# EAGLE design Spring2020 (EAGLE 9.6.2)
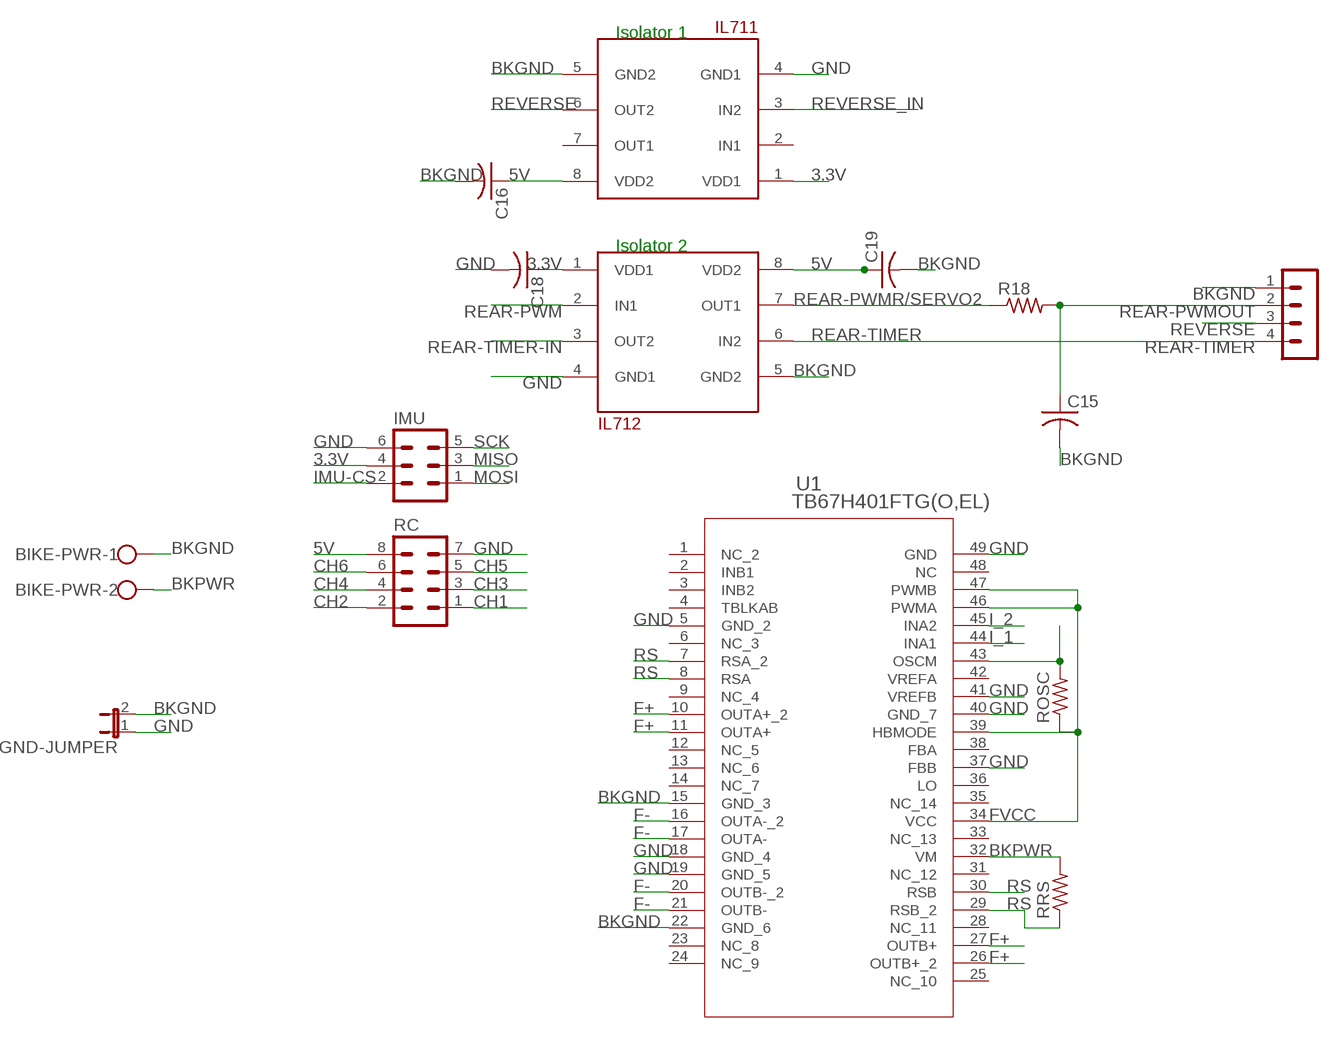
[diagram p0: schematic, sheet 1]

## Parts
BIKE-PWR  W237-102  [W237-102]
C15  C-US025-050X050  [C025-050X050]
C16  C-US025-050X050  [C025-050X050]
C18  C-US025-050X050  [C025-050X050]
C19  C-US025-050X050  [C025-050X050]
GND-JUMPER  JP1E  [JP1]
IMU  MA03-2  [MA03-2]
R18  R-US_0414/15  [0414/15]
RC  MA04-2  [MA04-2]
REAR-MOTOR  MA04-1  [MA04-1]
ROSC  R-US_0309/10  [0309/10]
RRS  R-US_0309/10  [0309/10]
U1  TB67H401FTG(O,EL)  [P-VQFN48-0707-0P50-004_TOS]
U$2  IL-711  [8PINSOIC]
U$7  IL-712  [8PINSOIC]

## Nets
3.3V: C18.1 IMU.4 U$2.1(VDD1) U$7.1(VDD1)
5V: C16.1 C19.1 RC.8 U$2.8(VDD2) U$7.8(VDD2)
BKGND: BIKE-PWR.1 C15.2 C16.2 C19.2 GND-JUMPER.2 REAR-MOTOR.1 U1.15(GND_3) U1.22(GND_6) U$2.5(GND2) U$7.5(GND2)
BKPWR: BIKE-PWR.2 RRS.2 U1.32(VM)
CH1: RC.1
CH2: RC.2
CH3: RC.3
CH4: RC.4
CH5: RC.5
CH6: RC.6
F+: U1.10(OUTA+_2) U1.11(OUTA+) U1.26(OUTB+_2) U1.27(OUTB+)
F-: U1.16(OUTA-_2) U1.17(OUTA-) U1.20(OUTB-_2) U1.21(OUTB-)
FVCC: ROSC.1 U1.34(VCC) U1.39(HBMODE) U1.46(PWMA) U1.47(PWMB)
GND: C18.2 GND-JUMPER.1 IMU.6 RC.7 U1.5(GND_2) U1.18(GND_4) U1.19(GND_5) U1.37(FBB) U1.40(GND_7) U1.41(VREFB) U1.49(GND) U$2.4(GND1) U$7.4(GND1)
I_1: U1.44(INA1)
I_2: U1.45(INA2)
IMU-CS: IMU.2
MISO: IMU.3
MOSI: IMU.1
N$5: ROSC.2 U1.43(OSCM)
REAR-PWM: U$7.2(IN1)
REAR-PWMOUT: C15.1 R18.2 REAR-MOTOR.2
REAR-PWMR/SERVO2: R18.1 U$7.7(OUT1)
REAR-TIMER: REAR-MOTOR.4 U$7.6(IN2)
REAR-TIMER-IN: U$7.3(OUT2)
REVERSE: REAR-MOTOR.3 U$2.6(OUT2)
REVERSE_IN: U$2.3(IN2)
RS: RRS.1 U1.7(RSA_2) U1.8(RSA) U1.29(RSB_2) U1.30(RSB)
SCK: IMU.5
Unconnected: U1.1(NC_2) U1.2(INB1) U1.3(INB2) U1.4(TBLKAB) U1.6(NC_3) U1.9(NC_4) U1.12(NC_5) U1.13(NC_6) U1.14(NC_7) U1.23(NC_8) U1.24(NC_9) U1.25(NC_10) U1.28(NC_11) U1.31(NC_12) U1.33(NC_13) U1.35(NC_14) U1.36(LO) U1.38(FBA) U1.48(NC) U$2.2(IN1) U$2.7(OUT1)

## Notes on the sheet
- Isolator 1
- Isolator 2

## Power pins joined to a net without a drawn wire
VREFA: U1.42(VREFA)

## Library data of the parts
BIKE-PWR = con-wago-500:W237-102: WAGO SCREW CLAMP; MPN: 237-102; OC_FARNELL: unknown; OC_NEWARK: 70K9898
C15 C16 C18 C19 = resistor:C-US: CAPACITOR, American symbol
GND-JUMPER = jumper:JP1E: JUMPER
IMU = con-lstb:MA03-2: PIN HEADER; OC_FARNELL: unknown; OC_NEWARK: unknown
R18 = resistor:R-US_: RESISTOR, American symbol
RC = con-lstb:MA04-2: PIN HEADER; OC_FARNELL: unknown; OC_NEWARK: unknown
REAR-MOTOR = con-lstb:MA04-1: PIN HEADER; OC_FARNELL: unknown; OC_NEWARK: unknown
ROSC RRS = rcl:R-US_: RESISTOR, American symbol
U1 = mclr:TB67H401FTG(O,EL); COPYRIGHT: Copyright (C) 2022 Ultra Librarian. All rights reserved.; DIGI-KEY_PART_NUMBER_1: TB67H401FTG(OEL)TR-ND; DIGI-KEY_PART_NUMBER_2: TB67H401FTG(OEL)CT-ND; DIGI-KEY_PART_NUMBER_3: TB67H401FTG(OEL)DKR-ND; MANUFACTURER_PART_NUMBER: TB67H401FTG(O,EL); MFR_NAME: Toshiba Electronic Devices & Storage Co.
U$2 = Spring2016Optoisolator:IL-711
U$7 = Spring2016Optoisolator:IL-712

## Board
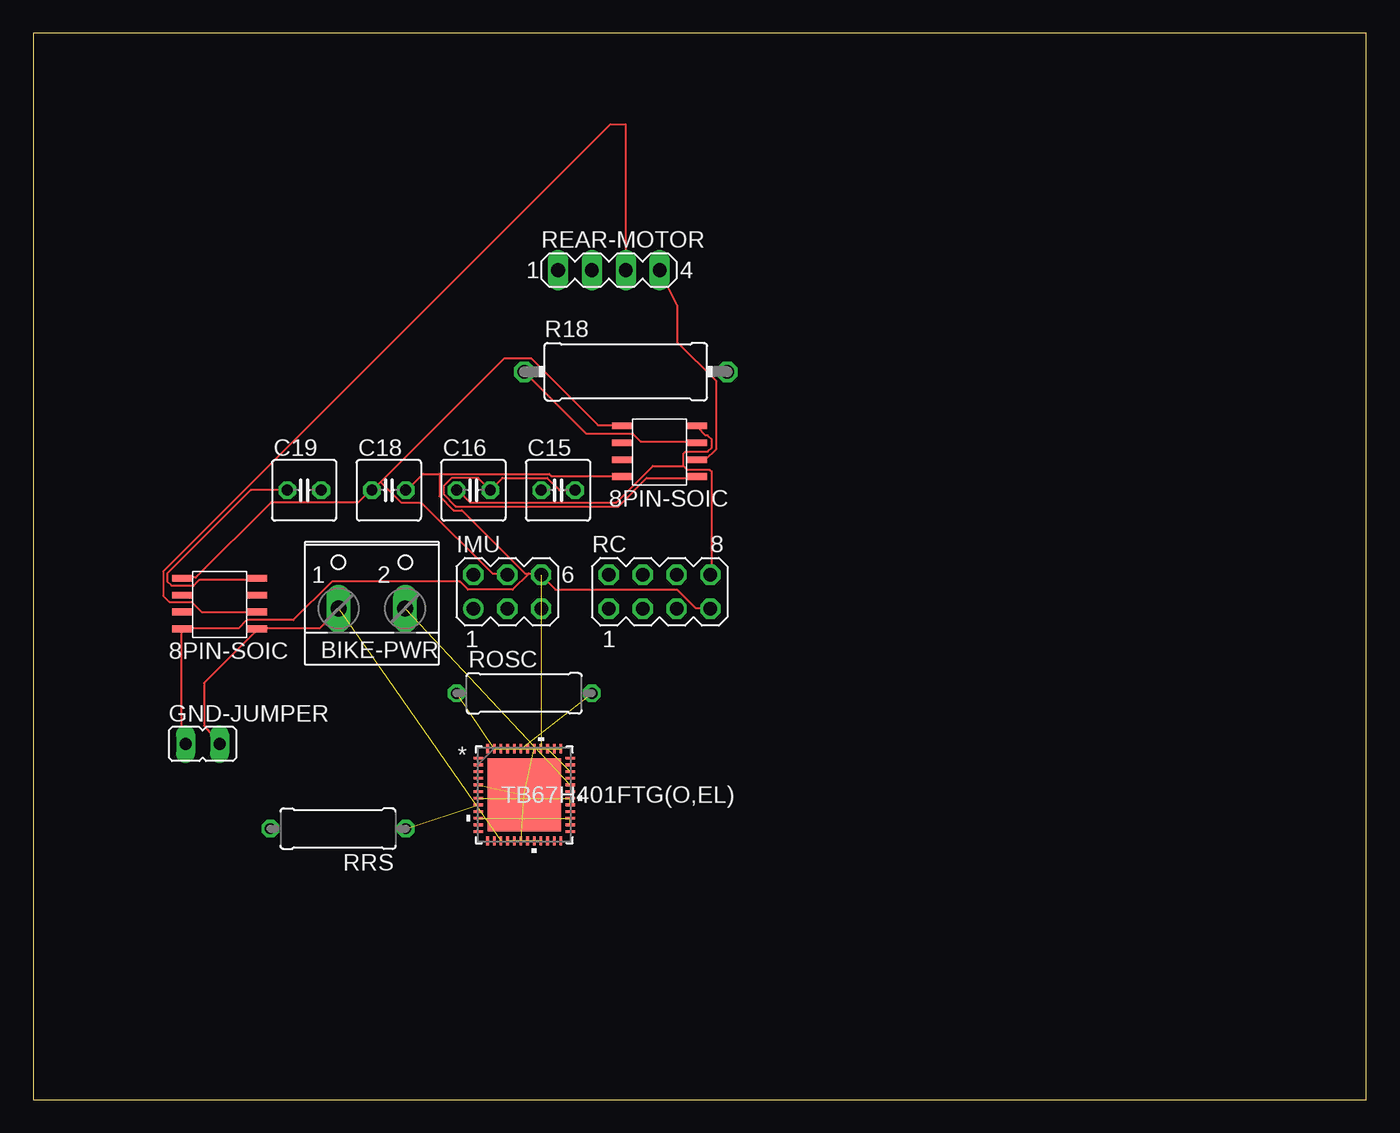
[diagram p1: board, top side]
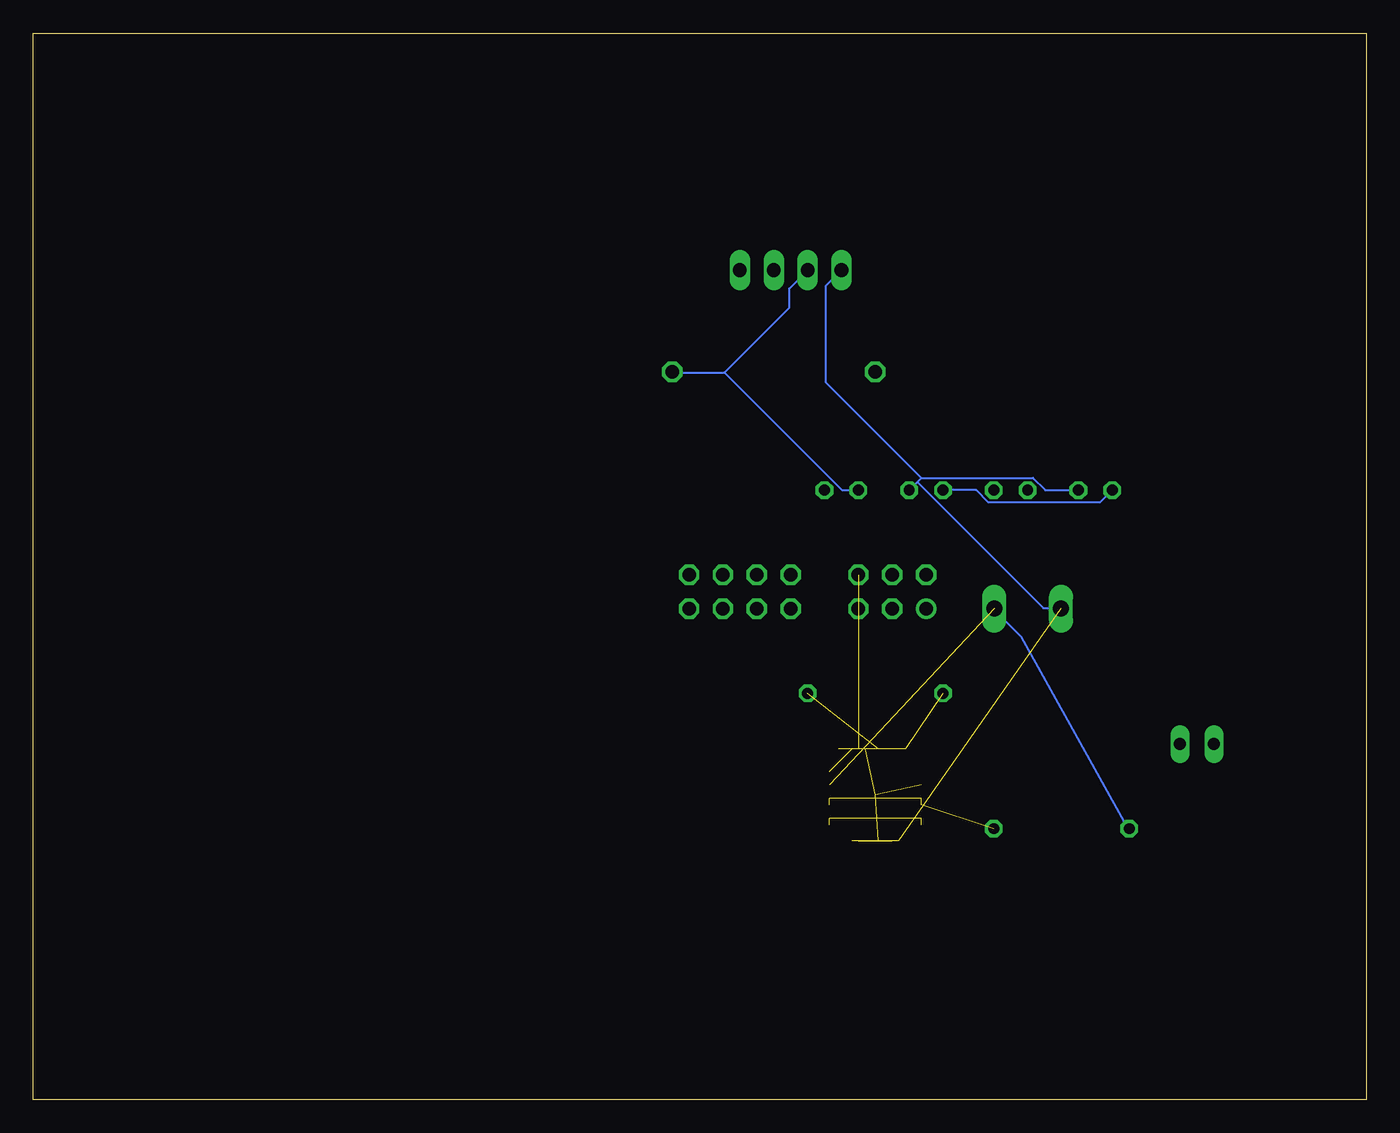
[diagram p2: board, bottom side, seen from below]

Size 100 x 80 mm. Coordinates in mm from the lower left corner, seen from the top.
Outline: 0,0 100,0 100,80 0,80 0,0
Copper layers (1*16): Top 0.035mm / dielectric 1.5mm / Bottom 0.035mm
Design rules "default": minimum track width 6mil, minimum drill 0.35mm, track to track 6mil, track to pad 6mil, pad to pad 6mil, via to via 6mil, smd to smd 6mil, copper to edge 40mil, drill to drill 6mil, minimum pad ring 10mil, minimum via ring 8mil, stop-mask expansion 4mil, vias tented up to drill 0mil, thermal gap 10mil

### Footprints (pad centres in the part's own frame; a part is rotated, then mirrored left to right if it is on the bottom)
W237-102 = drill 1.194 long: 1 -2.5,-1.27; 2 2.5,-1.27
C025-050X050 = drill 0.813 octagon: 1 -1.27,0; 2 1.27,0
JP1 = drill 0.914 long: 1 0,-1.27; 2 0,1.27
MA03-2 = drill 1.016: 1 -2.54,-1.27 | drill 1.016 octagon: 2 -2.54,1.27; 3 0,-1.27; 4 0,1.27; 5 2.54,-1.27; 6 2.54,1.27
0414/15 = drill 1.016 octagon: 1 -7.62,0; 2 7.62,0
MA04-2 = drill 1.016 octagon: 1 -3.81,-1.27; 2 -3.81,1.27; 3 -1.27,-1.27; 4 -1.27,1.27; 5 1.27,-1.27; 6 1.27,1.27; 7 3.81,-1.27; 8 3.81,1.27
MA04-1 = drill 1.016 long: 1 -3.81,0; 2 -1.27,0; 3 1.27,0; 4 3.81,0
0309/10 = drill 0.813 octagon: 1 -5.08,0; 2 5.08,0
P-VQFN48-0707-0P50-004_TOS = smd 0.705 x 0.199: 1 -3.452,2.75; 2 -3.452,2.25; 3 -3.452,1.75; 4 -3.452,1.25; 5 -3.452,0.75; 6 -3.452,0.25; 7 -3.452,-0.25; 8 -3.452,-0.75; 9 -3.452,-1.25; 10 -3.452,-1.75; 11 -3.452,-2.25; 12 -3.452,-2.75; 25 3.452,-2.75; 26 3.452,-2.25; 27 3.452,-1.75; 28 3.452,-1.25; 29 3.452,-0.75; 30 3.452,-0.25; 31 3.452,0.25; 32 3.452,0.75; 33 3.452,1.25; 34 3.452,1.75; 35 3.452,2.25; 36 3.452,2.75 | smd 0.199 x 0.705: 13 -2.75,-3.452; 14 -2.25,-3.452; 15 -1.75,-3.452; 16 -1.25,-3.452; 17 -0.75,-3.452; 18 -0.25,-3.452; 19 0.25,-3.452; 20 0.75,-3.452; 21 1.25,-3.452; 22 1.75,-3.452; 23 2.25,-3.452; 24 2.75,-3.452; 37 2.75,3.452; 38 2.25,3.452; 39 1.75,3.452; 40 1.25,3.452; 41 0.75,3.452; 42 0.25,3.452; 43 -0.25,3.452; 44 -0.75,3.452; 45 -1.25,3.452; 46 -1.75,3.452; 47 -2.25,3.452; 48 -2.75,3.452 | smd 5.5 x 5.5: 49 0,0
8PINSOIC = smd 1.524 x 0.508: 1 -2.794,2.286; 2 -2.794,1.016; 3 -2.794,-0.254; 4 -2.794,-1.524; 5 2.794,-1.524; 6 2.794,-0.254; 7 2.794,1.016; 8 2.794,2.286

### Placement (x,y rotation side)
BIKE-PWR  25.4,38.1 0 top
C15  39.37,45.72 0 top
C16  33.02,45.72 0 top
C18  26.67,45.72 0 top
C19  20.32,45.72 0 top
GND-JUMPER  12.7,26.67 270 top
IMU  35.56,38.1 0 top
R18  44.45,54.61 0 top
RC  46.99,38.1 0 top
REAR-MOTOR  43.18,62.23 0 top
ROSC  36.83,30.48 0 top
RRS  22.86,20.32 180 top
U1  36.83,22.86 0 top
U$2  13.97,36.83 0 top
U$7  46.99,48.26 0 top

### Tracks (layer width: path | path; a pad name or v marks a point on that pad's centre or on a via)
3.3V
  Top 0.152: U$2.1 11.28,39.17 12.19,39.17 17.83,44.81 24.38,44.81 25.3,45.72 C18.1 25.45,45.72 26.06,46.33 | 26.06,46.33 35.36,55.63 37.34,55.63 42.37,50.6 44.2,50.6 U$7.1 | 26.06,46.33 27.58,44.81 29.11,44.81 34.44,39.47 35.51,39.47 IMU.4
5V
  Top 0.152: 48.77,47.55 48.77,48.46 48.92,48.62 50.6,48.62 50.9,48.92 50.9,49.53 50.6,49.84 50.44,49.84 49.84,50.44 U$7.8 | 48.77,47.55 49.07,47.24 50.75,47.24 50.9,47.09 50.9,39.47 RC.8 | C19.1 16.31,45.72 10.06,39.47 10.06,38.86 10.36,38.56 12.04,38.56 12.5,39.01 16.76,39.01 U$2.8 | 48.77,47.55 46.48,47.55 43.74,44.81 32.77,44.81 31.85,45.72 C16.1
  Bottom 0.152: C16.1 29.26,45.72 28.35,44.81 19.96,44.81 C19.1
BKGND  (2 unrouted)
  Top 0.152: BIKE-PWR.1 22.86,36.73 21.49,35.36 16.76,35.36 U$2.5 16.76,35.2 12.8,31.24 12.8,28.04 GND-JUMPER.2 | U$7.5 49.68,46.63 46.02,46.63 43.89,44.5 31.7,44.5 30.79,45.41 30.79,46.02 31.39,46.63 33.38,46.63 C16.2 35.2,46.63 38.56,46.63 39.47,45.72 C15.2
  Bottom 0.152: C19.2 24.08,45.72 24.99,46.63 33.38,46.63 | C16.2 33.68,46.33 | 33.68,46.33 33.38,46.63 | 33.38,46.63 40.54,53.8 40.54,61.06 REAR-MOTOR.1 | 33.68,46.33 24.23,36.88 23.01,36.88 BIKE-PWR.1
BKPWR  (1 unrouted)
  Bottom 0.152: RRS.2 17.98,20.52 25.91,34.75 27.89,36.73 BIKE-PWR.2
F+  (3 unrouted)
F-  (3 unrouted)
FVCC  (4 unrouted)
GND  (7 unrouted)
  Top 0.152: GND-JUMPER.1 11.12,26.98 11.12,35.2 U$2.4 11.28,35.36 15.39,35.36 16,35.97 19.51,35.97 22.4,38.86 32,38.86 32.61,38.25 35.97,38.25 37.19,39.47 | 30.48,46.94 29.26,46.94 28.04,45.72 C18.2 | 30.48,46.94 38.71,46.94 38.86,46.79 44.2,46.79 U$7.4 | 37.19,39.47 36.88,39.47 32.16,44.2 31.55,44.2 30.48,45.26 30.48,46.94 | 37.19,39.47 38.1,39.47 IMU.6 38.1,39.32 39.17,38.25 48.31,38.25 49.68,36.88 50.75,36.88 RC.7
N$5  (1 unrouted)
REAR-PWMOUT
  Bottom 0.152: C15.1 39.32,45.72 48.16,54.56 | 48.16,54.56 51.97,54.56 R18.2 | 48.16,54.56 43.28,59.44 43.28,60.86 REAR-MOTOR.2
REAR-PWMR/SERVO2
  Top 0.152: R18.1 41.45,49.99 44.96,49.99 45.57,49.38 49.68,49.38 U$7.7
REAR-TIMER
  Top 0.152: U$7.6 50.44,48.01 51.21,48.77 51.21,53.95 48.31,56.84 48.31,59.59 REAR-MOTOR.4
REVERSE
  Top 0.152: U$2.6 12.65,36.58 11.89,37.34 10.21,37.34 9.75,37.8 9.75,39.62 43.28,73.15 44.45,73.15 REAR-MOTOR.3
RS  (4 unrouted)